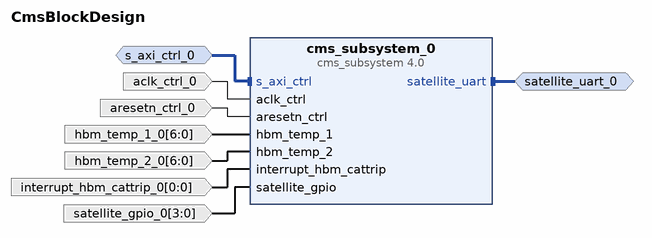
[diagram p0: block diagram of the top level]
# Vivado block design CmsBlockDesign, xcu55n-fsvh2892-2L-e, Vivado 2024.2
create_bd_design CmsBlockDesign

create_bd_intf_port -mode Master -vlnv xilinx.com:interface:uart_rtl:1.0 satellite_uart_0
create_bd_intf_port -mode Slave -vlnv xilinx.com:interface:aximm_rtl:1.0 s_axi_ctrl_0
set_property -dict [list \
  CONFIG.ADDR_WIDTH 18 \
  CONFIG.ARUSER_WIDTH 0 \
  CONFIG.AWUSER_WIDTH 0 \
  CONFIG.BUSER_WIDTH 0 \
  CONFIG.DATA_WIDTH 32 \
  CONFIG.FREQ_HZ 50000000 \
  CONFIG.HAS_BRESP 1 \
  CONFIG.HAS_BURST 0 \
  CONFIG.HAS_CACHE 0 \
  CONFIG.HAS_LOCK 0 \
  CONFIG.HAS_PROT 0 \
  CONFIG.HAS_QOS 0 \
  CONFIG.HAS_REGION 0 \
  CONFIG.HAS_RRESP 1 \
  CONFIG.HAS_WSTRB 1 \
  CONFIG.ID_WIDTH 0 \
  CONFIG.INSERT_VIP 1 \
  CONFIG.MAX_BURST_LENGTH 1 \
  CONFIG.NUM_READ_OUTSTANDING 2 \
  CONFIG.NUM_READ_THREADS 1 \
  CONFIG.NUM_WRITE_OUTSTANDING 2 \
  CONFIG.NUM_WRITE_THREADS 1 \
  CONFIG.PROTOCOL AXI4LITE \
  CONFIG.READ_WRITE_MODE READ_WRITE \
  CONFIG.RUSER_BITS_PER_BYTE 0 \
  CONFIG.RUSER_WIDTH 0 \
  CONFIG.SUPPORTS_NARROW_BURST 0 \
  CONFIG.WUSER_BITS_PER_BYTE 0 \
  CONFIG.WUSER_WIDTH 0 \
] [get_bd_intf_ports s_axi_ctrl_0]
create_bd_port -dir I -from 3 -to 0 -type intr satellite_gpio_0
set_property -dict {CONFIG.PortWidth 4 CONFIG.SENSITIVITY EDGE_RISING} [get_bd_ports satellite_gpio_0]
create_bd_port -dir I -type clk aclk_ctrl_0
set_property -dict {CONFIG.FREQ_HZ 50000000} [get_bd_ports aclk_ctrl_0]
create_bd_port -dir I -type rst aresetn_ctrl_0
create_bd_port -dir I -from 0 -to 0 -type intr interrupt_hbm_cattrip_0
set_property -dict {CONFIG.PortWidth 1} [get_bd_ports interrupt_hbm_cattrip_0]
create_bd_port -dir I -from 6 -to 0 hbm_temp_1_0
create_bd_port -dir I -from 6 -to 0 hbm_temp_2_0

create_bd_cell -type ip -vlnv xilinx.com:ip:cms_subsystem:4.0 cms_subsystem_0

# ---- connections ----

connect_bd_intf_net [get_bd_intf_ports satellite_uart_0] [get_bd_intf_pins cms_subsystem_0/satellite_uart]
connect_bd_intf_net -intf_net s_axi_ctrl_0_1 [get_bd_intf_ports s_axi_ctrl_0] [get_bd_intf_pins cms_subsystem_0/s_axi_ctrl]
connect_bd_net -net aclk_ctrl_0_1 [get_bd_ports aclk_ctrl_0] [get_bd_pins cms_subsystem_0/aclk_ctrl]
connect_bd_net -net aresetn_ctrl_0_1 [get_bd_ports aresetn_ctrl_0] [get_bd_pins cms_subsystem_0/aresetn_ctrl]
connect_bd_net -net hbm_temp_1_0_1 [get_bd_ports hbm_temp_1_0] [get_bd_pins cms_subsystem_0/hbm_temp_1]
connect_bd_net -net hbm_temp_2_0_1 [get_bd_ports hbm_temp_2_0] [get_bd_pins cms_subsystem_0/hbm_temp_2]
connect_bd_net -net interrupt_hbm_cattrip_0_1 [get_bd_ports interrupt_hbm_cattrip_0] [get_bd_pins cms_subsystem_0/interrupt_hbm_cattrip]
connect_bd_net -net satellite_gpio_0_1 [get_bd_ports satellite_gpio_0] [get_bd_pins cms_subsystem_0/satellite_gpio]

# ---- address map ----
assign_bd_address -offset 0x00000 -range 256K -target_address_space [get_bd_addr_spaces s_axi_ctrl_0] [get_bd_addr_segs cms_subsystem_0/s_axi_ctrl/Mem]

validate_bd_design
save_bd_design
